# Altium project GDI.PrjPcb
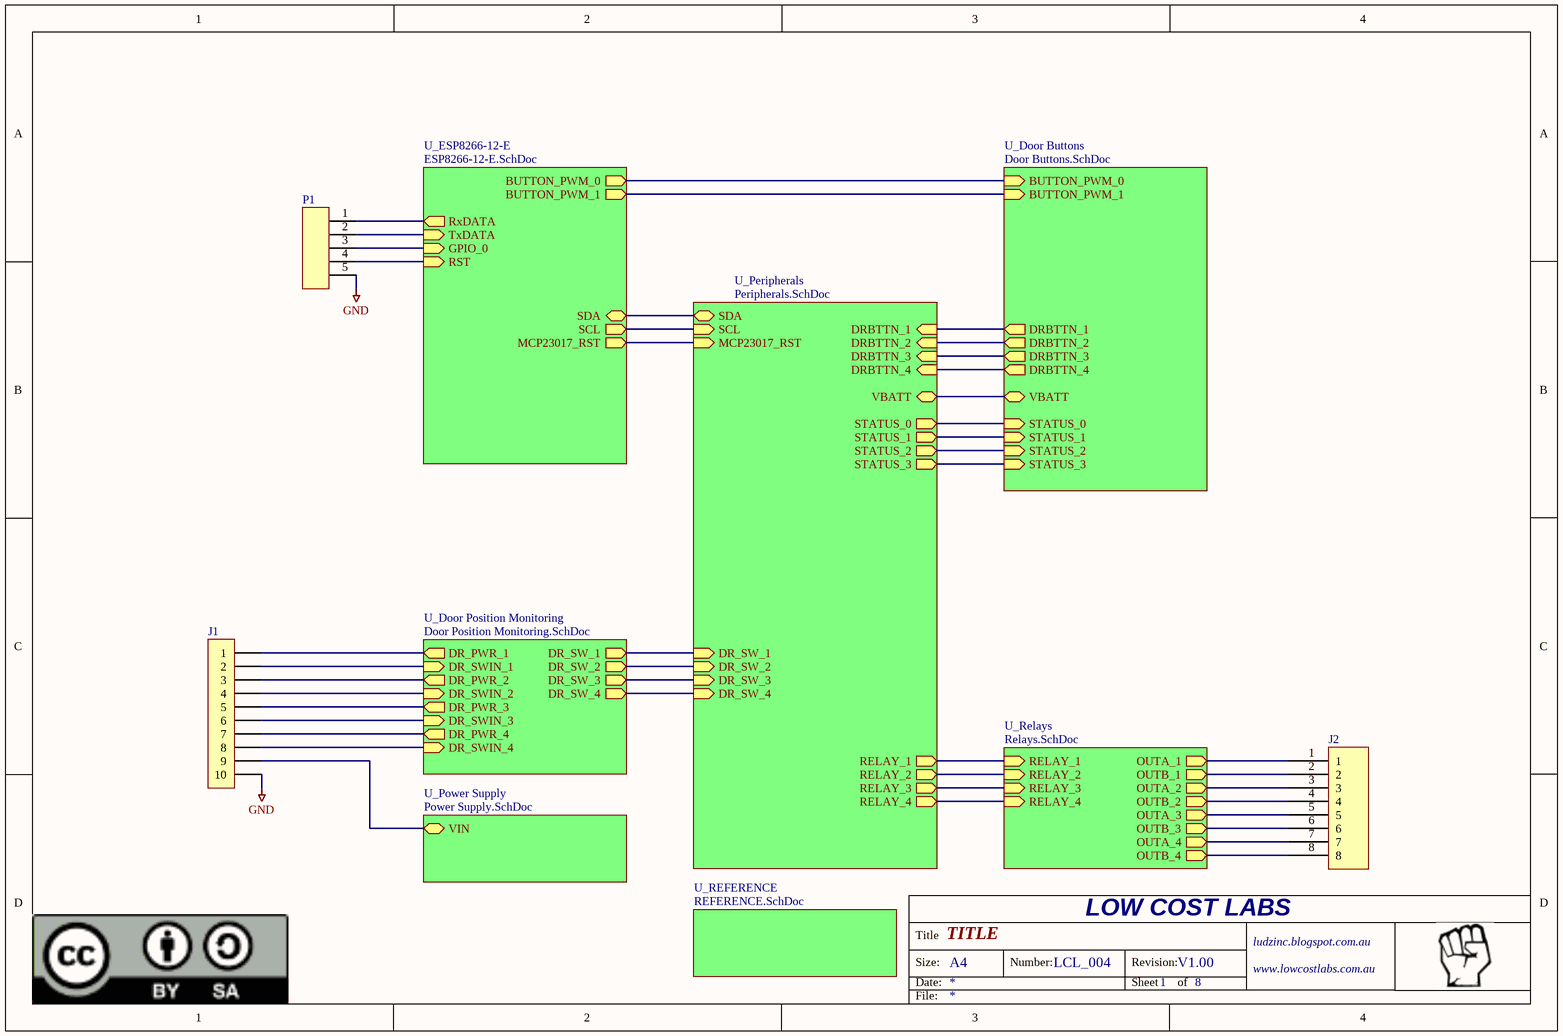
[diagram p0: Garage Interface.SchDoc]
8 sheets, 93 parts. Net scope: hierarchical (ports join the sheet entries above them; power ports are global).
Board file: GDI V2.PcbDoc
Sheets:
  Garage Interface.SchDoc
    U_Power Supply = Power Supply.SchDoc
    U_ESP8266-12-E = ESP8266-12-E.SchDoc
    U_Peripherals = Peripherals.SchDoc
    U_Relays = Relays.SchDoc
    U_Door Buttons = Door Buttons.SchDoc
    U_Door Position Monitoring = Door Position Monitoring.SchDoc
    U_REFERENCE = REFERENCE.SchDoc

## Sheet Garage Interface.SchDoc: TITLE
size A4; Address1: ludzinc.blogspot.com.au; Address3: www.lowcostlabs.com.au; DocumentNumber: LCL_004; Revision: V1.00; SheetNumber: 1; SheetTotal: 8

### Parts
J1  Phoenix Contact MSTBA 2,5/10-G-5,08-LR  [PCB-724730-1]  (value not drawn)
J2  Phoenix Contact MSTBA 2,5/ 8-G-5,08-LR  [PCB-724730-1]  (value not drawn)
P1  TE Connectivity 825433-5  [PCB-xti7u9j93a3qzo3mq4li-1]  (value not drawn)

### Sub-sheets
U_Door Buttons = Door Buttons.SchDoc: DRBTTN_1 (out), DRBTTN_2 (out), DRBTTN_3 (out), DRBTTN_4 (out), VBATT, BUTTON_PWM_1 (in), BUTTON_PWM_0 (in), STATUS_0 (in), STATUS_1 (in), STATUS_2 (in), STATUS_3 (in)
U_Door Position Monitoring = Door Position Monitoring.SchDoc: DR_SW_1 (out), DR_SWIN_1 (in), DR_SW_2 (out), DR_SWIN_2 (in), DR_SW_3 (out), DR_SWIN_3 (in), DR_SW_4 (out), DR_SWIN_4 (in), DR_PWR_2 (out), DR_PWR_1 (out), DR_PWR_3 (out), DR_PWR_4 (out)
U_ESP8266-12-E = ESP8266-12-E.SchDoc: RxDATA (out), TxDATA (in), SDA (bidir), SCL (out), BUTTON_PWM_1 (out), BUTTON_PWM_0 (out), GPIO_0 (in), RST (in), MCP23017_RST (out)
U_Peripherals = Peripherals.SchDoc: SDA (bidir), SCL (in), DRBTTN_1 (in), DRBTTN_2 (in), DRBTTN_3 (in), DRBTTN_4 (in), DR_SW_1 (in), DR_SW_2 (in), DR_SW_3 (in), DR_SW_4 (in), RELAY_1 (out), RELAY_2 (out), RELAY_3 (out), RELAY_4 (out), VBATT, MCP23017_RST (in), STATUS_0 (out), STATUS_2 (out), STATUS_1 (out), STATUS_3 (out)
U_Power Supply = Power Supply.SchDoc: VIN
U_REFERENCE = REFERENCE.SchDoc: no entries
U_Relays = Relays.SchDoc: RELAY_1 (in), OUTA_1 (out), OUTB_1 (out), RELAY_2 (in), RELAY_3 (in), RELAY_4 (in), OUTA_2 (out), OUTB_2 (out), OUTA_3 (out), OUTB_3 (out), OUTA_4 (out), OUTB_4 (out)

### Nets
GND: J1.10 P1.5
BUTTON_PWM_0: sheet U_ESP8266-12-E/BUTTON_PWM_0, sheet U_Door Buttons/BUTTON_PWM_0
BUTTON_PWM_1: sheet U_ESP8266-12-E/BUTTON_PWM_1, sheet U_Door Buttons/BUTTON_PWM_1
DR_SW_1: sheet U_Peripherals/DR_SW_1, sheet U_Door Position Monitoring/DR_SW_1
DR_SW_2: sheet U_Peripherals/DR_SW_2, sheet U_Door Position Monitoring/DR_SW_2
DR_SW_3: sheet U_Peripherals/DR_SW_3, sheet U_Door Position Monitoring/DR_SW_3
DR_SW_4: sheet U_Peripherals/DR_SW_4, sheet U_Door Position Monitoring/DR_SW_4
DRBTTN_1: sheet U_Peripherals/DRBTTN_1, sheet U_Door Buttons/DRBTTN_1
DRBTTN_2: sheet U_Peripherals/DRBTTN_2, sheet U_Door Buttons/DRBTTN_2
DRBTTN_3: sheet U_Peripherals/DRBTTN_3, sheet U_Door Buttons/DRBTTN_3
DRBTTN_4: sheet U_Peripherals/DRBTTN_4, sheet U_Door Buttons/DRBTTN_4
GPIO_0: P1.3 ; sheet U_ESP8266-12-E/GPIO_0
MCP23017_RST: sheet U_ESP8266-12-E/MCP23017_RST, sheet U_Peripherals/MCP23017_RST
RELAY_1: sheet U_Peripherals/RELAY_1, sheet U_Relays/RELAY_1
RELAY_2: sheet U_Peripherals/RELAY_2, sheet U_Relays/RELAY_2
RELAY_3: sheet U_Peripherals/RELAY_3, sheet U_Relays/RELAY_3
RELAY_4: sheet U_Peripherals/RELAY_4, sheet U_Relays/RELAY_4
RST: P1.4 ; sheet U_ESP8266-12-E/RST
SCL: sheet U_ESP8266-12-E/SCL, sheet U_Peripherals/SCL
SDA: sheet U_ESP8266-12-E/SDA, sheet U_Peripherals/SDA
STATUS_0: sheet U_Peripherals/STATUS_0, sheet U_Door Buttons/STATUS_0
STATUS_1: sheet U_Peripherals/STATUS_1, sheet U_Door Buttons/STATUS_1
STATUS_2: sheet U_Peripherals/STATUS_2, sheet U_Door Buttons/STATUS_2
STATUS_3: sheet U_Peripherals/STATUS_3, sheet U_Door Buttons/STATUS_3
VBATT: sheet U_Peripherals/VBATT, sheet U_Door Buttons/VBATT
NetF1_1: J1.9 ; sheet U_Power Supply/VIN
NetJ1_1: J1.1 ; sheet U_Door Position Monitoring/DR_PWR_1
NetJ1_2: J1.2 ; sheet U_Door Position Monitoring/DR_SWIN_1
NetJ1_3: J1.3 ; sheet U_Door Position Monitoring/DR_PWR_2
NetJ1_4: J1.4 ; sheet U_Door Position Monitoring/DR_SWIN_2
NetJ1_5: J1.5 ; sheet U_Door Position Monitoring/DR_PWR_3
NetJ1_6: J1.6 ; sheet U_Door Position Monitoring/DR_SWIN_3
NetJ1_7: J1.7 ; sheet U_Door Position Monitoring/DR_PWR_4
NetJ1_8: J1.8 ; sheet U_Door Position Monitoring/DR_SWIN_4
NetJ2_1: J2.1 ; sheet U_Relays/OUTA_1
NetJ2_2: J2.2 ; sheet U_Relays/OUTB_1
NetJ2_3: J2.3 ; sheet U_Relays/OUTA_2
NetJ2_4: J2.4 ; sheet U_Relays/OUTB_2
NetJ2_5: J2.5 ; sheet U_Relays/OUTA_3
NetJ2_6: J2.6 ; sheet U_Relays/OUTB_3
NetJ2_7: J2.7 ; sheet U_Relays/OUTA_4
NetJ2_8: J2.8 ; sheet U_Relays/OUTB_4
NetP1_1: P1.1 ; sheet U_ESP8266-12-E/RxDATA
NetP1_2: P1.2 ; sheet U_ESP8266-12-E/TxDATA

### Notes on the sheet
- LOW COST LABS
- Title
- Size:
- Date:
- A4
- Number:
- Revision:
- Sheet
- of
- File:

### Library data of the parts
J1 = CMP-eaf52240fd3f3532-1: Header, Right Angle, 5.08mm, 10way; Gender: Male; Number of Contacts: 10; OctopartID: eaf52240fd3f3532; RoHS: Compliant; Octopart URL: http://octopart.com/mstba+2%2C5%2F10-g-5%2C08-lr-phoenix+contact-29307564; Contact Plating: Tin; Mounting Style: PCB; Manufacturer Part Number: MSTBA 2,5/10-G-5,08-LR
J2 = CMP-e6fb2e4ef137393c-1: Header, Right Angle, 5.08mm, 8way; Gender: Male; Number of Contacts: 8; Contact Plating: Tin; Manufacturer Part Number: MSTBA 2,5/ 8-G-5,08-LR; OctopartID: e6fb2e4ef137393c; Mounting Style: PCB; Octopart URL: http://octopart.com/mstba+2%2C5%2F+8-g-5%2C08-lr-phoenix+contact-29307562; RoHS: Compliant
P1 = CMP-a17c6af386817ebb-11: Conn Unshrouded Header HDR 5 POS 2.54mm Solder ST Thru-Hole

## Sheet Power Supply.SchDoc: LCL_GDI (DELUX)
size A4; Address1: ludzinc.blogspot.com.au; Address3: www.lowcostlabs.com.au; DocumentNumber: LCL_004; Revision: V2.00; SheetNumber: 2; SheetTotal: 8
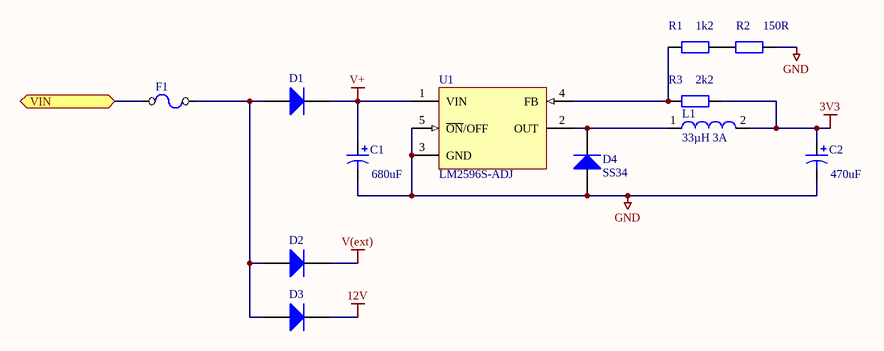
[diagram p1: Power Supply.SchDoc]

### Parts
C1  680uF  [PCB-jznsty645daf9i4vncxx-1]
C2  470uF  [PCB-jznsty645daf9i4vncxx-1]
D1  Vishay / Semiconductors S1MHE3/61T  [ONSC-SMA-2-403D-02_V]  (value not drawn)
D2  Vishay / Semiconductors S1MHE3/61T  [ONSC-SMA-2-403D-02_V]  (value not drawn)
D3  Vishay / Semiconductors S1MHE3/61T  [ONSC-SMA-2-403D-02_V]  (value not drawn)
D4  SS34  [PCB-16344855-1]
F1  1210L110/12WR  [PCB-8881447-1]  (value not drawn)
L1  33µH 3A  [WE-PD-L]
R1  1k2  [PCB-3652081-2]
R2  150R  [PCB-3652081-2]
R3  2k2  [PCB-3652081-2]
U1  LM2596S-ADJ  [TS5B_L]

### Ports
VIN

### Nets
3V3: C2.1 L1.2 R3.2
12V: D3.2(K)
GND: C1.2 C2.2 D4.1(A) R2.2 U1.3(GND) U1.5(~{ON}/OFF)
V(ext): D2.2(K)
V+: C1.1 D1.2(K) U1.1(VIN)
NetD1_1: D1.1(A) D2.1(A) D3.1(A) F1.2
NetD4_2: D4.2(K) L1.1 U1.2(OUT)
NetF1_1: F1.1 ; port VIN
NetR1_1: R1.1 R3.1 U1.4(FB)
NetR1_2: R1.2 R2.1

### Notes on the sheet
- LOW COST LABS
- Title
- Size:
- Date:
- A4
- Number:
- Revision:
- Sheet
- of
- File:

### Library data of the parts
C1 C2 = CMP-jznsty645daf9i4vncxx-1: Capacitor Electrolytic E-Case (8mm Diameter); CustomComponentID: jznsty645daf9i4vncxx
D1-D3 = Vishay / Semiconductors S1MHE3/61T-4: DIODE GPP 1A 1000V SMA DO-214AC; Max Surge Current: 30 A; Recovery Time: 1800 ns; CiivaID: 3109060; Reverse Current IR: 5 uA; Configuration: Single; Forward Voltage Drop: 1.1 V; Packaging: Reel; Forward Continuous Current: 1 A; Manufacturer Part Number: S1MHE3/61T; Minimum Operating Temperature: - 55 C; Ciiva URL: https://ciiva.com/part/s1mhe3-61t-3109060; RoHS: Details; Manufacturer: Vishay; Mounting Style: SMD/SMT; Reverse Voltage: 1000 V; Product: Standard Recovery Rectifiers; Package / Case: SMA; Maximum Operating Temperature: + 150 C; Factory Pack Quantity: 1800; Product Category: Rectifiers
D4 = Fairchild Semiconductor SS34-2: DIODE SCHOTTKY 40V 3A SMC; Power Dissipation Limit-Max (W): 2.27; Configuration: SINGLE; Number of Phases: 1; Package Body Material: PLASTIC/EPOXY; JEDEC-95 Code: DO-214AB; Diode Element Material: SILICON; CiivaID: 16344855; CAGE Code: 1HBD3,07933,59621,7D893; Non-rep Pk Forward Current-Max (A): 100; Average Forward Current-Max (A): 3; Rep Pk Reverse Voltage-Max (V): 40; Rectifier Diode Type: RECTIFIER DIODE; Rectifier Diode Application: GENERAL PURPOSE; Terminal Finish: MATTE TIN; Package Style: SMALL OUTLINE; Terminal Form: C BEND; JESD-30 Code: R-PDSO-C2; Ciiva URL: https://ciiva.com/part/ss34-16344855; Surface Mount: YES; Manufacturer Part Number: SS34; Package Shape: RECTANGULAR; Technology: SCHOTTKY; Number of Elements: 1; Number of Terminals: 2; Moisture Sensitivity Level: 1; Peak Reflow Temperature (Cel): 260; JESD-97 Code: e3; Terminal Position: DUAL; RoHS Compliant: YES; Lead Free: YES
F1 = CMP-8881447-2: PTC 12V POLYFUSE SMT 1210 1.10A; Brand: Littelfuse; Manufacturer: Littelfuse; Product Category: Resettable Fuses - PPTC; CiivaID: 8881447; RoHS: Details; Manufacturer Part Number: 1210L110/12WR; Ciiva URL: https://ciiva.com/part/1210l110-12wr-8881447; Packaging: Reel; Factory Pack Quantity: 3000
L1 = CMP-pndpqninr9wk38ord9ee-1: SMD POWER INDUCTOR 12 x 12 mm; CustomComponentID: pndpqninr9wk38ord9ee
R1-R3 = CMP-rprrpiwz7au7w5x5ojb2-2: GENERIC 0805 RESISTOR; CustomComponentID: rprrpiwz7au7w5x5ojb2
U1 = LM2596S-ADJ-4: SIMPLE SWITCHER® Power Converter 150 KHz 3A Step-Down Voltage Regulator, 5-pin TO-263; Manufacturer: TI (Texas Instruments) / National Semiconductor; Output Voltage Max: 37V; No. of Outputs: 1; CiivaID: 2394759; Supply Voltage Max: 40V; SVHC: No SVHC (19-Dec-2012); Supply Voltage Min: 4.5V; Adjustable Output Voltage Min: 1.285V; Accuracy %: 4%; Frequency: 150kHz; Base Number: 2596; Input Voltage Min: 15V; No. of Pins: 5; Output Voltage Min: 1.23V; Voltage Regulator Type: Switching, Step Down (Buck), Inverting; Power Supply IC Type: Step-down switching regulator; Operating Temperature Max: 125Â°C; Operating Temperature Range: -40Â°C to +125Â°C; Package / Case: TO-263 (D2-Pak); Packaging: Tube; Voltage Regulator Case Style: TO-263; Output Current Max: 3A; Switch Output Current Isw Max: 3A; Termination Type: SMD; Ciiva URL: https://ciiva.com/part/lm2596s-adj-2394759; Output Current: 3A; Operating Temperature Min: -40Â°C; Input Voltage Max: 40V; Output Voltage: 37V; Primary Input Voltage: 40V; IC Generic Number: 2596

## Sheet ESP8266-12-E.SchDoc: TITLE
size A4; Address1: ludzinc.blogspot.com.au; Address3: www.lowcostlabs.com.au; DocumentNumber: LCL_004; Revision: V2.00; SheetNumber: 4; SheetTotal: 8
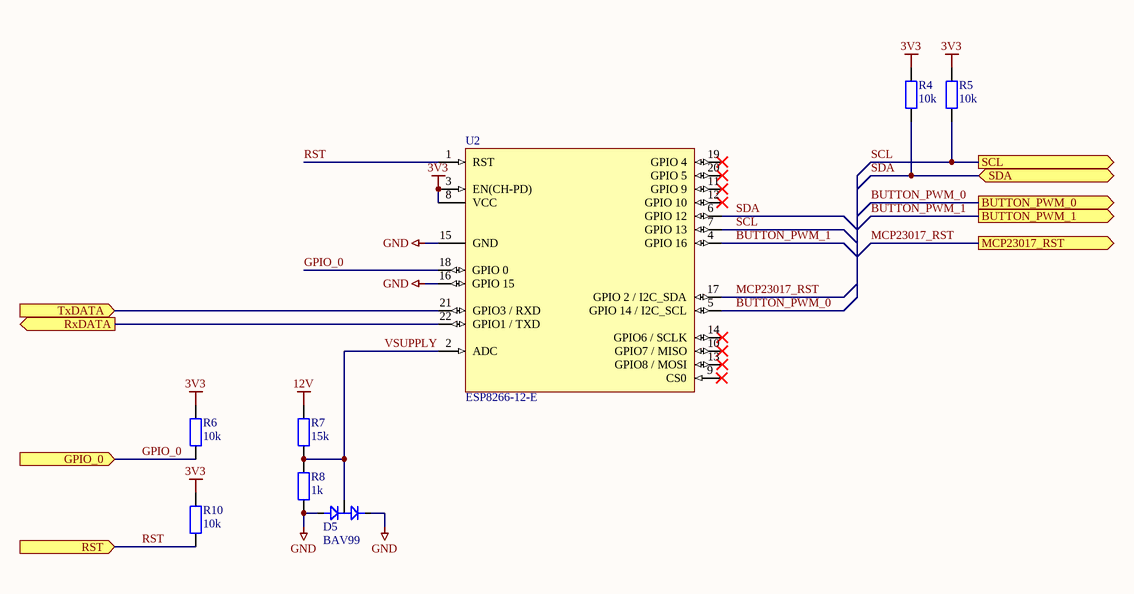
[diagram p2: ESP8266-12-E.SchDoc]

### Parts
D5  BAV99  [ONSC-SOT-23-3-318-08_V]
R4  10k  [PCB-3652081-2]
R5  10k  [PCB-3652081-2]
R6  10k  [PCB-3652081-2]
R7  15k  [PCB-3652081-2]
R8  1k  [PCB-3652081-2]
R10  10k  [PCB-3652081-2]
U2  ESP8266-12-E  [ESP-12E]

### Ports
BUTTON_PWM_0 (out), BUTTON_PWM_1 (out), GPIO_0 (in), MCP23017_RST (out), RST (in), RxDATA (out), SCL (out), SDA (bidir), TxDATA (in)

### Nets
3V3: R4.1 R5.2 R6.2 R10.2 U2.3(EN(CH-PD)) U2.8(VCC)
12V: R7.2
GND: D5.1(A) D5.2(K) R8.1 U2.15(GND) U2.16(GPIO_15)
BUTTON_PWM_0: U2.5(GPIO_14_/_I2C_SCL) ; port BUTTON_PWM_0
BUTTON_PWM_1: U2.4(GPIO_16) ; port BUTTON_PWM_1
GPIO_0: R6.1 U2.18(GPIO_0) ; port GPIO_0
MCP23017_RST: U2.17(GPIO_2_/_I2C_SDA) ; port MCP23017_RST
RST: R10.1 U2.1(RST) ; port RST
SCL: R5.1 U2.7(GPIO_13) ; port SCL
SDA: R4.2 U2.6(GPIO_12) ; port SDA
VSUPPLY: D5.3(K/A) R7.1 R8.2 U2.2(ADC)
NetP1_1: U2.22(GPIO1_/_TXD) ; port RxDATA
NetP1_2: U2.21(GPIO3_/_RXD) ; port TxDATA

Not connected (* = marked no-connect by the designer): U2 9(CS0)* 10(GPIO7_/_MISO)* 11(GPIO_9)* 12(GPIO_10)* 13(GPIO8_/_MOSI)* 14(GPIO6_/_SCLK)* 19(GPIO_4)* 20(GPIO_5)*

### Notes on the sheet
- LOW COST LABS
- Title
- Size:
- Date:
- A4
- Number:
- Revision:
- Sheet
- of
- File:

### Library data of the parts
D5 = CMP-10548246-4: Dual Series Switching Diodes, 3-Pin SOT-23, Pb-Free, Tape and Reel; Voltage Rating (DC): 70.0 V; Current Rating: 0.2 A; Lead-Free Status: Lead Free; Forward Voltage: 1.0 V; Capacitance: 1.5e-12 F; Case/Package: SOT-23; REACH SVHC Compliance: No SVHC; RoHS: Compliant; Octopart Url: https://octopart.com/bav99lt1g-on+semiconductor-55396102; Number of Pins: 3; Halogen Free Status: Halogen Free; Lifecycle Status: Active; Mounting Style: Surface Mount; OctopartID: b3e779a0d1876c20
R4-R8 R10 = CMP-rprrpiwz7au7w5x5ojb2-2: GENERIC 0805 RESISTOR; CustomComponentID: rprrpiwz7au7w5x5ojb2
U2 = CMP-2c9ce6e9266cf35b-4: ESP8266-12-E Wifi Module; Manufacturer Part Number: 2491; Octopart URL: http://octopart.com/2491-adafruit+industries-65271392; RoHS: Compliant; OctopartID: f2f4381d21f22d33; Material: PCB Module; Color: Black

## Sheet Peripherals.SchDoc: LCL_GDI (DELUX)
size A4; Address1: ludzinc.blogspot.com.au; Address3: www.lowcostlabs.com.au; DocumentNumber: LCL_004; Revision: V2.00; SheetNumber: 6; SheetTotal: 8
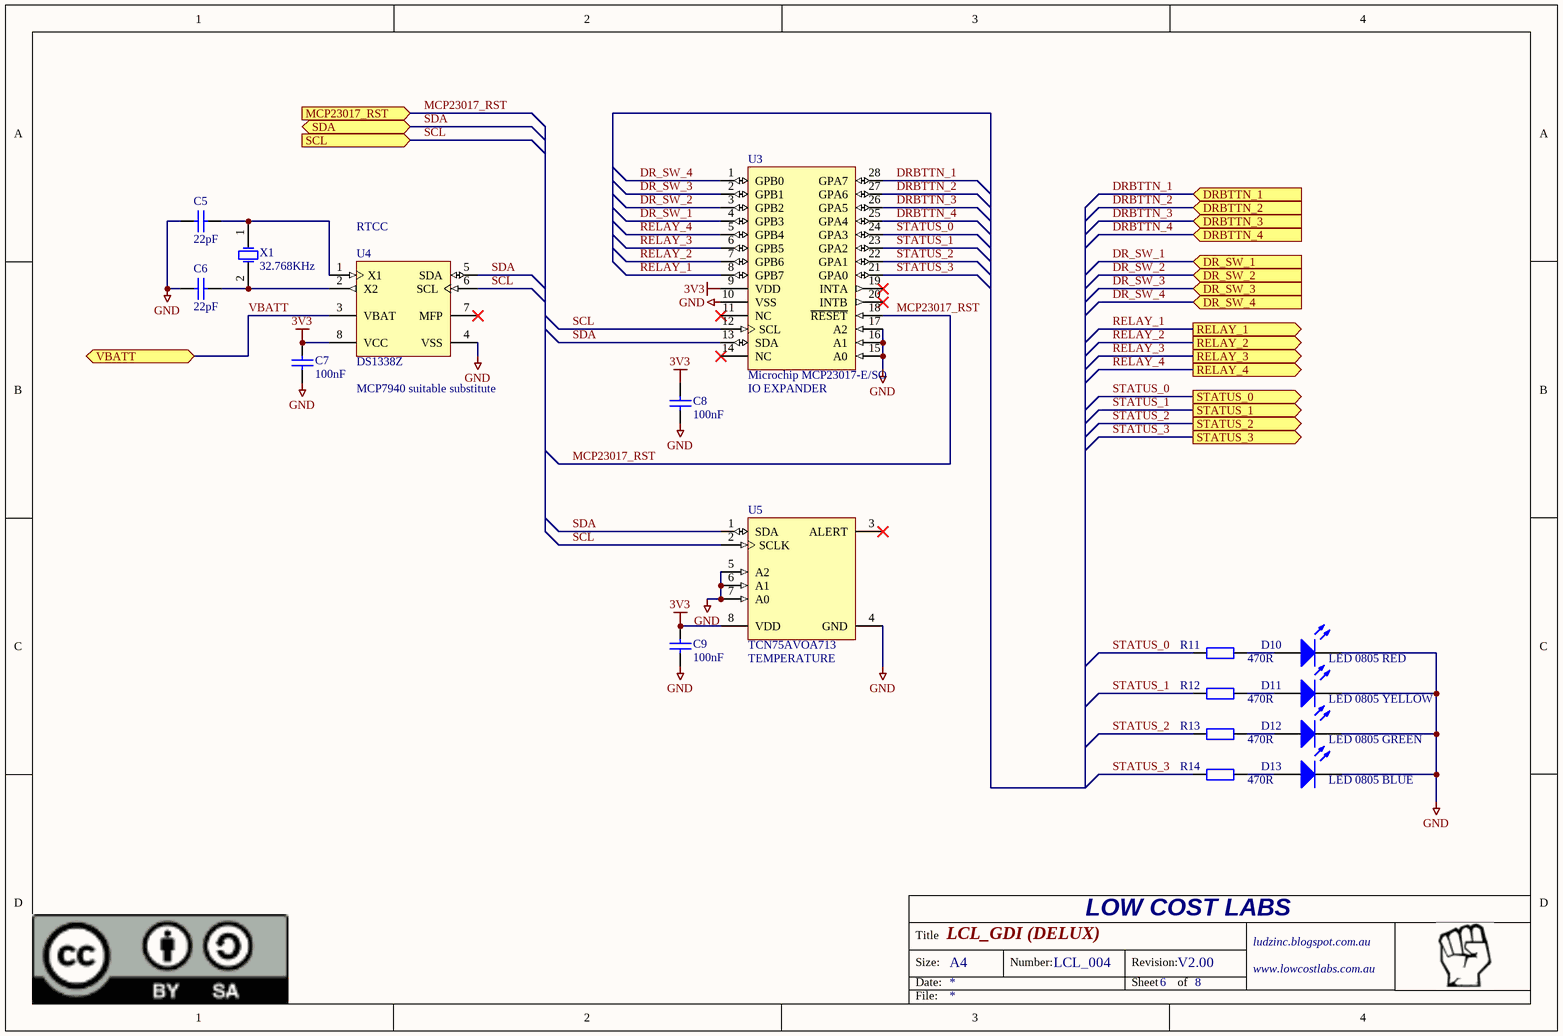
[diagram p3: Peripherals.SchDoc]

### Parts
C5  22pF  [PCB-vlqtv48lgr288fxw4eza-1]
C6  22pF  [PCB-vlqtv48lgr288fxw4eza-1]
C7  100nF  [PCB-vlqtv48lgr288fxw4eza-1]
C8  100nF  [PCB-vlqtv48lgr288fxw4eza-1]
C9  100nF  [PCB-vlqtv48lgr288fxw4eza-1]
D10  LED 0805 RED  [PCB-1071566-1]
D11  LED 0805 YELLOW  [PCB-jd3vqu3yujcdtm6p0xhq-1]
D12  LED 0805 GREEN  [PCB-1071566-1]
D13  LED 0805 BLUE  [PCB-kse1vp9j500ix6ujga0m-1]
R11  470R  [PCB-3652081-2]
R12  470R  [PCB-3652081-2]
R13  470R  [PCB-3652081-2]
R14  470R  [PCB-3652081-2]
U3  Microchip MCP23017-E/SO  [SOIC-SO28_N]
U4  DS1338Z  [SOIC-SN8_N]
U5  TCN75AVOA713  [SOIC-OA8_N]
X1  32.768KHz  [ABRA-AB15T-2_V]

### Ports
DR_SW_1 (in), DR_SW_2 (in), DR_SW_3 (in), DR_SW_4 (in), DRBTTN_1 (in), DRBTTN_2 (in), DRBTTN_3 (in), DRBTTN_4 (in), MCP23017_RST (in), RELAY_1 (out), RELAY_2 (out), RELAY_3 (out), RELAY_4 (out), SCL (in), SDA (bidir), STATUS_0 (out), STATUS_1 (out), STATUS_2 (out), STATUS_3 (out), VBATT

### Nets
3V3: C7.2 C8.2 C9.2 U3.9(VDD) U4.8(VCC) U5.8(VDD)
GND: C5.1 C6.1 C7.1 C8.1 C9.1 D10.K D11.K D12.K D13.K U3.10(VSS) U3.15(A0) U3.16(A1) U3.17(A2) U4.4(VSS) U5.4(GND) U5.5(A2) U5.6(A1) U5.7(A0)
DR_SW_1: U3.4(GPB3) ; port DR_SW_1
DR_SW_2: U3.3(GPB2) ; port DR_SW_2
DR_SW_3: U3.2(GPB1) ; port DR_SW_3
DR_SW_4: U3.1(GPB0) ; port DR_SW_4
DRBTTN_1: U3.28(GPA7) ; port DRBTTN_1
DRBTTN_2: U3.27(GPA6) ; port DRBTTN_2
DRBTTN_3: U3.26(GPA5) ; port DRBTTN_3
DRBTTN_4: U3.25(GPA4) ; port DRBTTN_4
MCP23017_RST: U3.18(~{RESET}) ; port MCP23017_RST
RELAY_1: U3.8(GPB7) ; port RELAY_1
RELAY_2: U3.7(GPB6) ; port RELAY_2
RELAY_3: U3.6(GPB5) ; port RELAY_3
RELAY_4: U3.5(GPB4) ; port RELAY_4
SCL: U3.12(SCL) U4.6(SCL) U5.2(SCLK) ; port SCL
SDA: U3.13(SDA) U4.5(SDA) U5.1(SDA) ; port SDA
STATUS_0: R11.1 U3.24(GPA3) ; port STATUS_0
STATUS_1: R12.1 U3.23(GPA2) ; port STATUS_1
STATUS_2: R13.1 U3.22(GPA1) ; port STATUS_2
STATUS_3: R14.1 U3.21(GPA0) ; port STATUS_3
VBATT: U4.3(VBAT) ; port VBATT
NetC5_2: C5.2 U4.1(X1) X1.1(X1)
NetC6_2: C6.2 U4.2(X2) X1.2(X2)
NetD10_A: D10.A R11.2
NetD11_A: D11.A R12.2
NetD12_A: D12.A R13.2
NetD13_A: D13.A R14.2

Not connected (* = marked no-connect by the designer): U3 11(NC)* 14(NC)* 19(INTA)* 20(INTB)*; U4 7(MFP)*; U5 3(ALERT)*

### Notes on the sheet
- (near U4) RTCC
- MCP7940 suitable substitute
- (near U3) IO EXPANDER
- (near U5) TEMPERATURE
- LOW COST LABS
- Title
- Size:
- Date:
- A4
- Number:
- Revision:
- Sheet
- of
- File:

### Library data of the parts
C5-C9 = CMP-hzp74w7y18pxh5z0pr7s-1: GENERIC 0805 CAPACITOR; CustomComponentID: hzp74w7y18pxh5z0pr7s
D10 = CMP-hyfk0d9q8jygmed95nz1-2: CustomComponentID: hyfk0d9q8jygmed95nz1
D11 = CMP-jd3vqu3yujcdtm6p0xhq-2: CustomComponentID: jd3vqu3yujcdtm6p0xhq
D12 = CMP-qw5bzvzxueusztn5titj-1: CustomComponentID: qw5bzvzxueusztn5titj
D13 = CMP-kse1vp9j500ix6ujga0m-3: CustomComponentID: kse1vp9j500ix6ujga0m
R11-R14 = CMP-rprrpiwz7au7w5x5ojb2-2: GENERIC 0805 RESISTOR; CustomComponentID: rprrpiwz7au7w5x5ojb2
U3 = CMP-1159041-5: MCP23017 Series 5.5 V 1.7 MHz SMT 16-Bit I2C I/O Expander - SOIC-28; Supply Voltage (DC): 5.50 V (max); Lead-Free Status: Lead Free; Supply Current: 1.00 mA; Number of Bits: 16; Octopart URL: http://octopart.com/mcp23017-e%2Fso-microchip-470557; Manufacturer Part Number: MCP23017-E/SO; RoHS: Compliant; REACH SVHC Compliance: No SVHC; Mounting Style: Surface Mount; Packaging: Tube; Case/Package: SOIC; Lifecycle Status: Active; Number of Pins: 28; OctopartID: 0ae1c3ec019ad526
U4 = CMP-1020935-2: Low-Cost I2C Real-Time Clock/Calendar with SRAM and Battery Switchover, 8-Pin SOIC, Industrial Temperature; Lead-Free Status: Lead Free; Lifecycle Status: Active; Mounting Style: Surface Mount; Number of Pins: 8; Octopart Url: https://octopart.com/mcp7940n-i%2Fsn-microchip-19668622; OctopartID: 406188477b899fa6; REACH SVHC Compliance: No SVHC; RoHS: Compliant
U5 = TCN75AVOA713-2: 2-Wire Serial Temperature Sensor, 8-Pin SOIC, Extended Temperature, Tape and Reel; Voltage - Supply: 2.7 V ~ 5.5 V; Sensing Temperature: -55°C ~ 125°C; Topology: ADC (Sigma Delta), Register Bank; CiivaID: 1467894; Output Fan: Yes; Sensor Type: Internal; Accuracy: ±3°C(Max); Output Type: I²CT; Output Alarm: No; Function: Temp Monitoring System (Sensor); Ciiva URL: https://ciiva.com/part/TCN75AVOA713-1467894; Mounting Type: Surface Mount; Supplier Device Package: 8-SOIC N; Packaging: Tape & Reel (TR); Operating Temperature: -55°C ~ 125°C; Family: PMIC - Thermal Management; Package / Case: 8-SOIC (0.154", 3.90mm Width); Category: Integrated Circuits (ICs); Standard Package: 3,300
X1 = CMP-781972-4: Low Frequency Cylindrical Watch Crystal, 32.768 kHz, -20 to 70 degC, 2-Pin 5 x 1.4 x 1.5 mm THD, RoHS, Bulk; Equivalent Series Resistance (ESR): 40000.0 Ω; Frequency: 32768.0 Hz; Lead Length: 0.0043 m; Lead-Free Status: Lead Free; Load Capacitance: 1.25e-11 F; Mounting Style: Through Hole; Number of Pins: 2; Octopart Url: https://octopart.com/ab15t-32.768khz-abracon-315480; OctopartID: 9fa556ab6a9b4062; Packaging: Bulk; REACH SVHC Compliance: No SVHC; RoHS: Compliant; Size-Height: 0.01346 m

## Sheet Relays.SchDoc: LCL_GDI (DELUX)
size A4; Address1: ludzinc.blogspot.com.au; Address3: www.lowcostlabs.com.au; DocumentNumber: LCL_004; Revision: V2.00; SheetNumber: 5; SheetTotal: 8
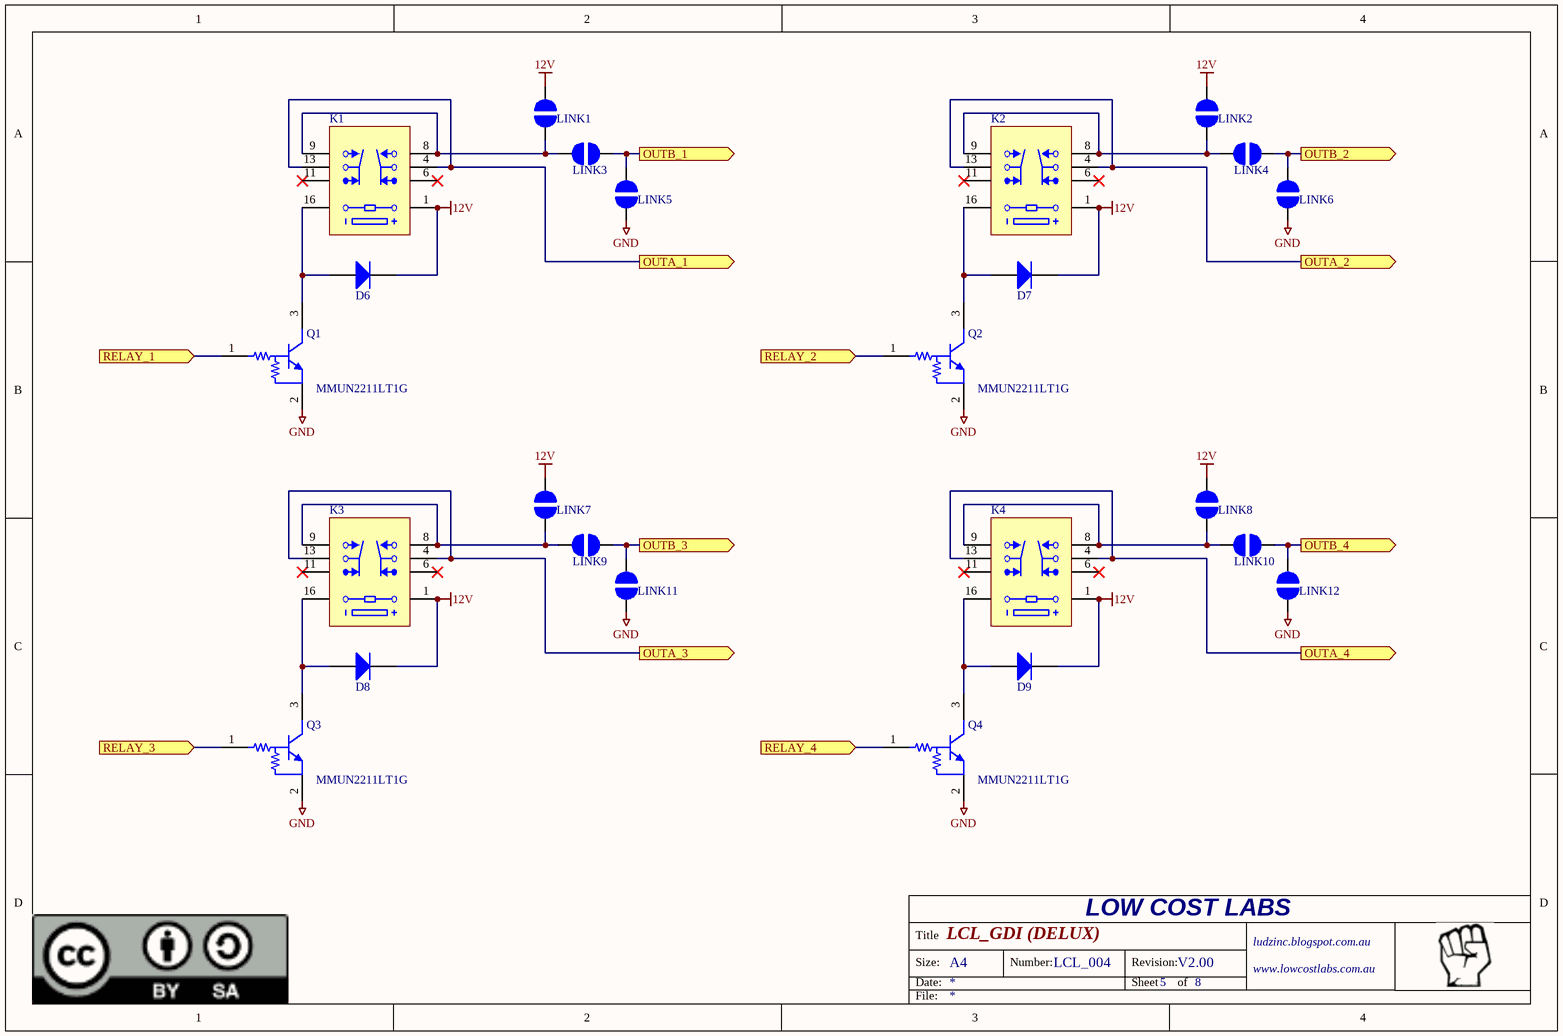
[diagram p4: Relays.SchDoc]

### Parts
D6  Vishay / Semiconductors S1MHE3/61T  [ONSC-SMA-2-403D-02_V]  (value not drawn)
D7  Vishay / Semiconductors S1MHE3/61T  [ONSC-SMA-2-403D-02_V]  (value not drawn)
D8  Vishay / Semiconductors S1MHE3/61T  [ONSC-SMA-2-403D-02_V]  (value not drawn)
D9  Vishay / Semiconductors S1MHE3/61T  [ONSC-SMA-2-403D-02_V]  (value not drawn)
K1  Panasonic DS2Y-S-DC12V  [PCB-d08qloczi00j7cf9smyl-1]  (value not drawn)
K2  Panasonic DS2Y-S-DC12V  [PCB-d08qloczi00j7cf9smyl-1]  (value not drawn)
K3  Panasonic DS2Y-S-DC12V  [PCB-d08qloczi00j7cf9smyl-1]  (value not drawn)
K4  Panasonic DS2Y-S-DC12V  [PCB-d08qloczi00j7cf9smyl-1]  (value not drawn)
LINK1  SOLDER JUMPER  [PCB-btzmmfon80v3o3bq8yuz-1]  (value not drawn)  (no BOM)
LINK2  SOLDER JUMPER  [PCB-btzmmfon80v3o3bq8yuz-1]  (value not drawn)  (no BOM)
LINK3  SOLDER JUMPER  [PCB-btzmmfon80v3o3bq8yuz-1]  (value not drawn)  (no BOM)
LINK4  SOLDER JUMPER  [PCB-btzmmfon80v3o3bq8yuz-1]  (value not drawn)  (no BOM)
LINK5  SOLDER JUMPER  [PCB-btzmmfon80v3o3bq8yuz-1]  (value not drawn)  (no BOM)
LINK6  SOLDER JUMPER  [PCB-btzmmfon80v3o3bq8yuz-1]  (value not drawn)  (no BOM)
LINK7  SOLDER JUMPER  [PCB-btzmmfon80v3o3bq8yuz-1]  (value not drawn)  (no BOM)
LINK8  SOLDER JUMPER  [PCB-btzmmfon80v3o3bq8yuz-1]  (value not drawn)  (no BOM)
LINK9  SOLDER JUMPER  [PCB-btzmmfon80v3o3bq8yuz-1]  (value not drawn)  (no BOM)
LINK10  SOLDER JUMPER  [PCB-btzmmfon80v3o3bq8yuz-1]  (value not drawn)  (no BOM)
LINK11  SOLDER JUMPER  [PCB-btzmmfon80v3o3bq8yuz-1]  (value not drawn)  (no BOM)
LINK12  SOLDER JUMPER  [PCB-btzmmfon80v3o3bq8yuz-1]  (value not drawn)  (no BOM)
Q1  MMUN2211LT1G  [ONSC-SOT-23-3-318-08_V]
Q2  MMUN2211LT1G  [ONSC-SOT-23-3-318-08_V]
Q3  MMUN2211LT1G  [ONSC-SOT-23-3-318-08_V]
Q4  MMUN2211LT1G  [ONSC-SOT-23-3-318-08_V]

### Ports
OUTA_1 (out), OUTA_2 (out), OUTA_3 (out), OUTA_4 (out), OUTB_1 (out), OUTB_2 (out), OUTB_3 (out), OUTB_4 (out), RELAY_1 (in), RELAY_2 (in), RELAY_3 (in), RELAY_4 (in)

### Nets
12V: D6.2(K) D7.2(K) D8.2(K) D9.2(K) K1.1 K2.1 K3.1 K4.1 LINK1.1 LINK2.1 LINK7.1 LINK8.1
GND: LINK5.2 LINK6.2 LINK11.2 LINK12.2 Q1.2(E) Q2.2(E) Q3.2(E) Q4.2(E)
RELAY_1: Q1.1(B) ; port RELAY_1
RELAY_2: Q2.1(B) ; port RELAY_2
RELAY_3: Q3.1(B) ; port RELAY_3
RELAY_4: Q4.1(B) ; port RELAY_4
NetD6_1: D6.1(A) K1.16 Q1.3(C)
NetD7_1: D7.1(A) K2.16 Q2.3(C)
NetD8_1: D8.1(A) K3.16 Q3.3(C)
NetD9_1: D9.1(A) K4.16 Q4.3(C)
NetJ2_1: K1.4 K1.13 ; port OUTA_1
NetJ2_2: LINK3.2 LINK5.1 ; port OUTB_1
NetJ2_3: K2.4 K2.13 ; port OUTA_2
NetJ2_4: LINK4.2 LINK6.1 ; port OUTB_2
NetJ2_5: K3.4 K3.13 ; port OUTA_3
NetJ2_6: LINK9.2 LINK11.1 ; port OUTB_3
NetJ2_7: K4.4 K4.13 ; port OUTA_4
NetJ2_8: LINK10.2 LINK12.1 ; port OUTB_4
NetK1_8: K1.8 K1.9 LINK1.2 LINK3.1
NetK2_8: K2.8 K2.9 LINK2.2 LINK4.1
NetK3_8: K3.8 K3.9 LINK7.2 LINK9.1
NetK4_8: K4.8 K4.9 LINK8.2 LINK10.1

Not connected (* = marked no-connect by the designer): K1 6* 11*; K2 6* 11*; K3 6* 11*; K4 6* 11*

### Notes on the sheet
- LOW COST LABS
- Title
- Size:
- Date:
- A4
- Number:
- Revision:
- Sheet
- of
- File:

### Library data of the parts
D6-D9 = Vishay / Semiconductors S1MHE3/61T-4: as D1 on sheet Power Supply; Packaging: Reel; Forward Continuous Current: 1 A; Manufacturer Part Number: S1MHE3/61T; Minimum Operating Temperature: - 55 C; Ciiva URL: https://ciiva.com/part/s1mhe3-61t-3109060; RoHS: Details; Manufacturer: Vishay; Mounting Style: SMD/SMT; Reverse Voltage: 1000 V; Product: Standard Recovery Rectifiers; Package / Case: SMA; Maximum Operating Temperature: + 150 C; Factory Pack Quantity: 1800; Product Category: Rectifiers
K1-K4 = CMP-a9a660dd73707661-2: Relay; E-Mech; non-Latching; DPDT-NO/NC; Cur-Rtg 2A; Ctrl-V 12DC; Vol-Rtg 250/220AC/DC; Power Rating: 60.0 W; Lead-Free Status: Lead Free; Carry Current: 3.0 A; Rise Time: 0.004 s; Coil Resistance: 720.0 Ω; Contact Current Rating: 2.0 A; Coil Power (DC): 0.2 W; Coil Current: 0.0167 A; Contacts Type: DPDT; Coil Voltage: 12.0 V; Lifecycle Status: Active; Size-Length: 0.0199898 m; Octopart URL: http://octopart.com/ds2y-s-dc12v-panasonic-7471024; RoHS: Compliant; Mounting Style: PCB; Manufacturer Part Number: DS2Y-S-DC12V; Size-Height: 0.0092964 m; OctopartID: a9a660dd73707661; Size-Width: 0.009906 m; Packaging: Tray; Contact Material: Silver
LINK1-LINK12 = CMP-awopsk420h7r935fi2ee-3: CustomComponentID: awopsk420h7r935fi2ee
Q1-Q4 = CMP-866803-1: Digital Transistor (BRT), R1=10 kOhm, R2=10 kOhm, NPN Transistor, 3-Pin SOT-23, Pb-Free, Tape and Reel; SVHC: No SVHC (19-Dec-2012); Transistor Type: Bias Resistor (BRT); Power Dissipation Pd: 246mW; Collector Emitter Voltage Vces: -250mV; Pin Configuration: 1; Voltage Vcbo: 50V; No. of Pins: 3; Current Ic hFE: 5mA; DC Collector Current: 100mA; DC Current Gain hFE: 60; SMD Marking: A8A; Power Dissipation Ptot Max: 200mW; CiivaID: 866803; Hfe Min: 35; Resistance R1: 10kohm; Transistor Case Style: SOT-23; Transistor Polarity: NPN; Collector Emitter Voltage V(br)ceo: 50V; Ciiva URL: https://ciiva.com/part/MMUN2211LT1G-866803; Package / Case: SOT-23; No. of Transistors: 1; Resistance R2: 10kohm

## Sheet Door Buttons.SchDoc: TITLE
size A4; Address1: ludzinc.blogspot.com.au; Address3: www.lowcostlabs.com.au; DocumentNumber: LCL_004; Revision: V2.00; SheetNumber: 8; SheetTotal: 8
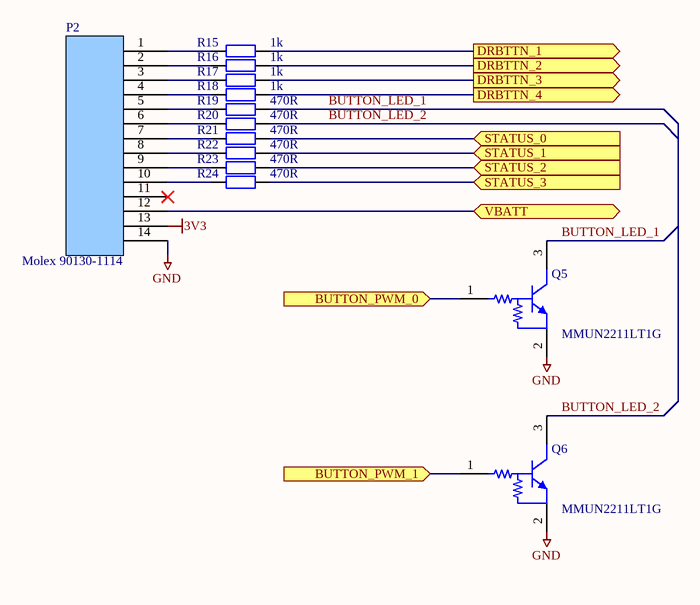
[diagram p5: Door Buttons.SchDoc]

### Parts
P2  Molex 90130-1114  [PCB-642648-1]
Q5  MMUN2211LT1G  [ONSC-SOT-23-3-318-08_V]
Q6  MMUN2211LT1G  [ONSC-SOT-23-3-318-08_V]
R15  1k  [PCB-3652081-2]
R16  1k  [PCB-3652081-2]
R17  1k  [PCB-3652081-2]
R18  1k  [PCB-3652081-2]
R19  470R  [PCB-3652081-2]
R20  470R  [PCB-3652081-2]
R21  470R  [PCB-3652081-2]
R22  470R  [PCB-3652081-2]
R23  470R  [PCB-3652081-2]
R24  470R  [PCB-3652081-2]

### Ports
BUTTON_PWM_0 (in), BUTTON_PWM_1 (in), DRBTTN_1 (out), DRBTTN_2 (out), DRBTTN_3 (out), DRBTTN_4 (out), STATUS_0 (in), STATUS_1 (in), STATUS_2 (in), STATUS_3 (in), VBATT

### Nets
3V3: P2.13
GND: P2.14 Q5.2(E) Q6.2(E)
BUTTON_LED_1: Q5.3(C) R19.2
BUTTON_LED_2: Q6.3(C) R20.2
BUTTON_PWM_0: Q5.1(B) ; port BUTTON_PWM_0
BUTTON_PWM_1: Q6.1(B) ; port BUTTON_PWM_1
DRBTTN_1: R15.2 ; port DRBTTN_1
DRBTTN_2: R16.2 ; port DRBTTN_2
DRBTTN_3: R17.2 ; port DRBTTN_3
DRBTTN_4: R18.2 ; port DRBTTN_4
STATUS_0: R21.2 ; port STATUS_0
STATUS_1: R22.2 ; port STATUS_1
STATUS_2: R23.2 ; port STATUS_2
STATUS_3: R24.2 ; port STATUS_3
VBATT: P2.12 ; port VBATT
NetP2_1: P2.1 R15.1
NetP2_2: P2.2 R16.1
NetP2_3: P2.3 R17.1
NetP2_4: P2.4 R18.1
NetP2_5: P2.5 R19.1
NetP2_6: P2.6 R20.1
NetP2_7: P2.7 R21.1
NetP2_8: P2.8 R22.1
NetP2_9: P2.9 R23.1
NetP2_10: P2.10 R24.1

Not connected (* = marked no-connect by the designer): P2 11*

### Notes on the sheet
- LOW COST LABS
- Title
- Size:
- Date:
- A4
- Number:
- Revision:
- Sheet
- of
- File:

### Library data of the parts
P2 = CMP-f8023102ddab27c5-1: Conn Shrouded Header HDR 14 POS 2.54mm Solder ST Thru-Hole C-Grid IIIáTray; Current Rating: 3.00 A; Gender: Male; Glow Wire Compliant: Non-Compliant; Lead-Free Status: Lead Free; Number of Circuits: 12, 14; Number of Contacts: 14; Octopart URL: https://octopart.com/90130-1114-molex-655567; Manufacturer Part Number: 90130-1114; Color: Black; Contact Material: Brass; Contact Plating: Tin; Halogen Free Status: Not Low Halogen; Housing Color: Black; Housing Material: Plastic; Lifecycle Status: Active; Mounting Style: Through Hole, Vertical; Number of Positions: 14; Number of Rows: 2; Operating Temperature: 125 °C (max); Orientation: Straight; Packaging: Tray; Pin Pitch: 2.54 mm; RoHS: Compliant; Size-Height: 10.9 mm; Size-Length: 20.5 mm; Size-Width: 9.75 mm; OctopartID: f8023102ddab27c5
Q5 Q6 = CMP-866803-1: as Q1 on sheet Relays; Transistor Case Style: SOT-23; Transistor Polarity: NPN; Collector Emitter Voltage V(br)ceo: 50V; Ciiva URL: https://ciiva.com/part/MMUN2211LT1G-866803; Package / Case: SOT-23; No. of Transistors: 1; Resistance R2: 10kohm
R15-R24 = CMP-rprrpiwz7au7w5x5ojb2-2: GENERIC 0805 RESISTOR; CustomComponentID: rprrpiwz7au7w5x5ojb2

## Sheet Door Position Monitoring.SchDoc: LCL_GDI (DELUX)
size A4; Address1: ludzinc.blogspot.com.au; Address3: www.lowcostlabs.com.au; DocumentNumber: LCL_004; Revision: V2.00; SheetNumber: 7; SheetTotal: 8
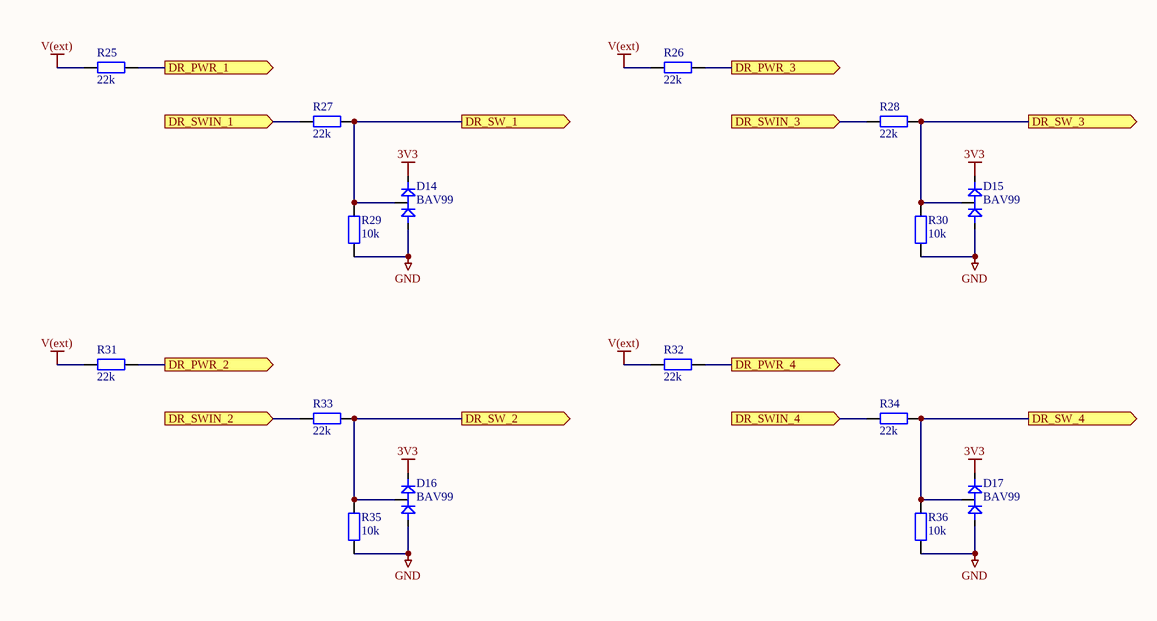
[diagram p6: Door Position Monitoring.SchDoc]

### Parts
D14  BAV99  [ONSC-SOT-23-3-318-08_V]
D15  BAV99  [ONSC-SOT-23-3-318-08_V]
D16  BAV99  [ONSC-SOT-23-3-318-08_V]
D17  BAV99  [ONSC-SOT-23-3-318-08_V]
R25  22k  [PCB-3652081-2]
R26  22k  [PCB-3652081-2]
R27  22k  [PCB-3652081-2]
R28  22k  [PCB-3652081-2]
R29  10k  [PCB-3652081-2]
R30  10k  [PCB-3652081-2]
R31  22k  [PCB-3652081-2]
R32  22k  [PCB-3652081-2]
R33  22k  [PCB-3652081-2]
R34  22k  [PCB-3652081-2]
R35  10k  [PCB-3652081-2]
R36  10k  [PCB-3652081-2]

### Ports
DR_PWR_1 (out), DR_PWR_2 (out), DR_PWR_3 (out), DR_PWR_4 (out), DR_SW_1 (out), DR_SW_2 (out), DR_SW_3 (out), DR_SW_4 (out), DR_SWIN_1 (in), DR_SWIN_2 (in), DR_SWIN_3 (in), DR_SWIN_4 (in)

### Nets
3V3: D14.2(K) D15.2(K) D16.2(K) D17.2(K)
GND: D14.1(A) D15.1(A) D16.1(A) D17.1(A) R29.1 R30.1 R35.1 R36.1
V(ext): R25.2 R26.2 R31.2 R32.2
DR_SW_1: D14.3(K/A) R27.1 R29.2 ; port DR_SW_1
DR_SW_2: D16.3(K/A) R33.1 R35.2 ; port DR_SW_2
DR_SW_3: D15.3(K/A) R28.1 R30.2 ; port DR_SW_3
DR_SW_4: D17.3(K/A) R34.1 R36.2 ; port DR_SW_4
NetJ1_1: R25.1 ; port DR_PWR_1
NetJ1_2: R27.2 ; port DR_SWIN_1
NetJ1_3: R31.1 ; port DR_PWR_2
NetJ1_4: R33.2 ; port DR_SWIN_2
NetJ1_5: R26.1 ; port DR_PWR_3
NetJ1_6: R28.2 ; port DR_SWIN_3
NetJ1_7: R32.1 ; port DR_PWR_4
NetJ1_8: R34.2 ; port DR_SWIN_4

### Notes on the sheet
- LOW COST LABS
- Title
- Size:
- Date:
- A4
- Number:
- Revision:
- Sheet
- of
- File:

### Library data of the parts
D14-D17 = CMP-10548246-4: as D5 on sheet ESP8266-12-E; Case/Package: SOT-23; REACH SVHC Compliance: No SVHC; RoHS: Compliant; Octopart Url: https://octopart.com/bav99lt1g-on+semiconductor-55396102; Number of Pins: 3; Halogen Free Status: Halogen Free; Lifecycle Status: Active; Mounting Style: Surface Mount; OctopartID: b3e779a0d1876c20
R25-R36 = CMP-rprrpiwz7au7w5x5ojb2-2: GENERIC 0805 RESISTOR; CustomComponentID: rprrpiwz7au7w5x5ojb2

## Sheet REFERENCE.SchDoc
size A4
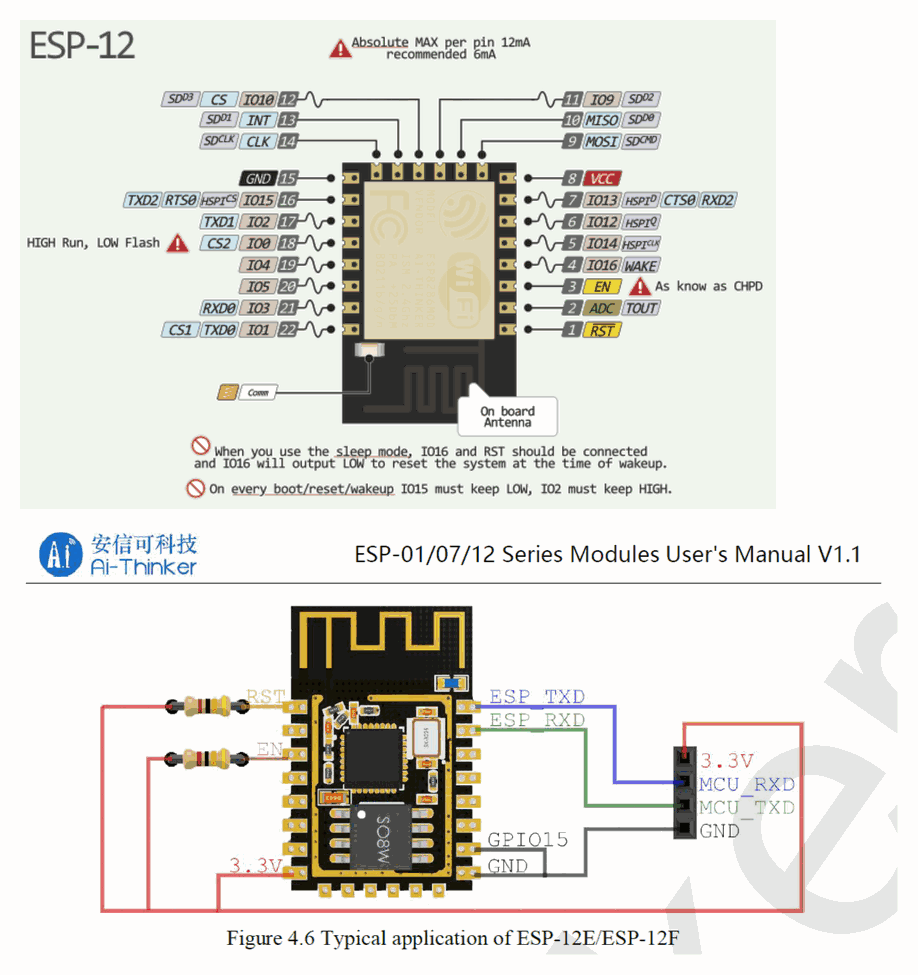
[diagram p7: REFERENCE.SchDoc]

## Nets that join several sheets
3V3: Power Supply (C2.1 L1.2 R3.2), ESP8266-12-E (6 pins), Peripherals (6 pins), Door Buttons (P2.13), Door Position Monitoring (D14.2 D15.2 D16.2 D17.2)
12V: Power Supply (D3.2), ESP8266-12-E (R7.2), Relays (12 pins)
GND: Garage Interface (J1.10 P1.5), Power Supply (6 pins), ESP8266-12-E (5 pins), Peripherals (18 pins), Relays (8 pins), Door Buttons (P2.14 Q5.2 Q6.2), Door Position Monitoring (8 pins)
V(ext): Power Supply (D2.2), Door Position Monitoring (R25.2 R26.2 R31.2 R32.2)
BUTTON_PWM_0: ESP8266-12-E (U2.5), Door Buttons (Q5.1)
BUTTON_PWM_1: ESP8266-12-E (U2.4), Door Buttons (Q6.1)
DR_SW_1: Peripherals (U3.4), Door Position Monitoring (D14.3 R27.1 R29.2)
DR_SW_2: Peripherals (U3.3), Door Position Monitoring (D16.3 R33.1 R35.2)
DR_SW_3: Peripherals (U3.2), Door Position Monitoring (D15.3 R28.1 R30.2)
DR_SW_4: Peripherals (U3.1), Door Position Monitoring (D17.3 R34.1 R36.2)
DRBTTN_1: Peripherals (U3.28), Door Buttons (R15.2)
DRBTTN_2: Peripherals (U3.27), Door Buttons (R16.2)
DRBTTN_3: Peripherals (U3.26), Door Buttons (R17.2)
DRBTTN_4: Peripherals (U3.25), Door Buttons (R18.2)
GPIO_0: Garage Interface (P1.3), ESP8266-12-E (R6.1 U2.18)
MCP23017_RST: ESP8266-12-E (U2.17), Peripherals (U3.18)
NetF1_1: Garage Interface (J1.9), Power Supply (F1.1)
NetJ1_1: Garage Interface (J1.1), Door Position Monitoring (R25.1)
NetJ1_2: Garage Interface (J1.2), Door Position Monitoring (R27.2)
NetJ1_3: Garage Interface (J1.3), Door Position Monitoring (R31.1)
NetJ1_4: Garage Interface (J1.4), Door Position Monitoring (R33.2)
NetJ1_5: Garage Interface (J1.5), Door Position Monitoring (R26.1)
NetJ1_6: Garage Interface (J1.6), Door Position Monitoring (R28.2)
NetJ1_7: Garage Interface (J1.7), Door Position Monitoring (R32.1)
NetJ1_8: Garage Interface (J1.8), Door Position Monitoring (R34.2)
NetJ2_1: Garage Interface (J2.1), Relays (K1.4 K1.13)
NetJ2_2: Garage Interface (J2.2), Relays (LINK3.2 LINK5.1)
NetJ2_3: Garage Interface (J2.3), Relays (K2.4 K2.13)
NetJ2_4: Garage Interface (J2.4), Relays (LINK4.2 LINK6.1)
NetJ2_5: Garage Interface (J2.5), Relays (K3.4 K3.13)
NetJ2_6: Garage Interface (J2.6), Relays (LINK9.2 LINK11.1)
NetJ2_7: Garage Interface (J2.7), Relays (K4.4 K4.13)
NetJ2_8: Garage Interface (J2.8), Relays (LINK10.2 LINK12.1)
NetP1_1: Garage Interface (P1.1), ESP8266-12-E (U2.22)
NetP1_2: Garage Interface (P1.2), ESP8266-12-E (U2.21)
RELAY_1: Peripherals (U3.8), Relays (Q1.1)
RELAY_2: Peripherals (U3.7), Relays (Q2.1)
RELAY_3: Peripherals (U3.6), Relays (Q3.1)
RELAY_4: Peripherals (U3.5), Relays (Q4.1)
RST: Garage Interface (P1.4), ESP8266-12-E (R10.1 U2.1)
SCL: ESP8266-12-E (R5.1 U2.7), Peripherals (U3.12 U4.6 U5.2)
SDA: ESP8266-12-E (R4.2 U2.6), Peripherals (U3.13 U4.5 U5.1)
STATUS_0: Peripherals (R11.1 U3.24), Door Buttons (R21.2)
STATUS_1: Peripherals (R12.1 U3.23), Door Buttons (R22.2)
STATUS_2: Peripherals (R13.1 U3.22), Door Buttons (R23.2)
STATUS_3: Peripherals (R14.1 U3.21), Door Buttons (R24.2)
VBATT: Peripherals (U4.3), Door Buttons (P2.12)